# Altium schematic sheet Latch power supply.SchDoc: PowerLatch
size A3; Author: Cedric Renda; DrawnBy: Cedric Renda; Organization: HSR; Address1: Hochschule für Technik Rapperswil; Address2: Elektrotechnik; Address3: Oberseestrasse 10; Address4: CH-8640 Rapperswil
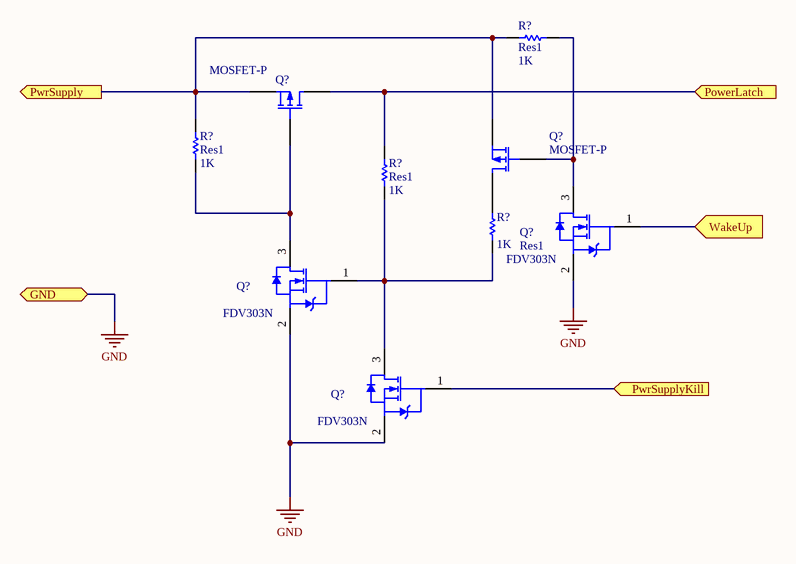
[diagram p0: Latch power supply.SchDoc]

## Parts
(Parts that share a designator on the sheet are numbered #1, #2 ... from top to bottom, then left to right.)
Q?#1  MOSFET-P  [E3]
Q?#2  MOSFET-P  [E3]
Q?#3  FDV303N  [FAIR-FDV303N-3_V]
Q?#4  FDV303N  [FAIR-FDV303N-3_V]
Q?#5  FDV303N  [FAIR-FDV303N-3_V]
R?#1  Res1  value 1K  [AXIAL-0.3]
R?#2  Res1  value 1K  [AXIAL-0.3]
R?#3  Res1  value 1K  [AXIAL-0.3]
R?#4  Res1  value 1K  [AXIAL-0.3]

## Ports
GND (bidir), PowerLatch (in), PwrSupply (out), PwrSupplyKill (in), WakeUp (in)

## Nets
GND: Q?#3.2(S) Q?#4.2(S) Q?#5.2(S) ; port GND
PowerLatch: Q?#1.1(D) R?#3.1 ; port PowerLatch
PwrSupply: Q?#1.3(S) Q?#2.3(S) R?#1.2 R?#2.1 ; port PwrSupply
PwrSupplyKill: Q?#5.1(G) ; port PwrSupplyKill
WakeUp: Q?#3.1(G) ; port WakeUp
NetQ?#1_2: Q?#1.2(G) Q?#4.3(D) R?#2.2
NetQ?#2_1: Q?#2.1(D) R?#4.2
NetQ?#2_2: Q?#2.2(G) Q?#3.3(D) R?#1.1
NetQ?#4_1: Q?#4.1(G) Q?#5.3(D) R?#3.2 R?#4.1

## Notes on the sheet
- Title
- Size:
- Date:
- A3
- Number:
- Time:
- Revision:
- Sheet
- of
- File:

## Library data of the parts
Q?#1 Q?#2 = MOSFET-P: P-Channel MOSFET; Published: 8-Jun-2000; LatestRevisionDate: 17-Jul-2002; LatestRevisionNote: Re-released for DXP Platform.; PackageVersion: 1995/1996; PackageReference: E3; Publisher: Altium Limited; PackageDescription: TO, Flat Index; 3 In-Line, Axial Leads; Body Dia. 4.6mm; Lead Dia. 0.5 mm (max)
Q?#3-Q?#5 = CMP-2000-05111-1: N-Channel MOSFET Transistor, 8 V VGSS, 25 V VDSS, 0.68 A, -55 to 150 degC, 3-Pin SOT23, RoHS, Tape and Reel; Manufacturer: Fairchild; Typical Turn-On Delay Time: 3ns; Channel Mode: Enhancement; RDS-on: 450@4.5VmOhm; Maximum Continuous Drain Current: 0.68A; Maximum Drain Source Voltage: 25V; Rad Hard: No; Typical Fall Time: 13ns; Channel Type: N; Typical Turn-Off Delay Time: 17ns; Maximum Gate Source Voltage: 8V; Typical Rise Time: 8.5ns; Mounting: SurfaceMount; Packaging: Tape&Reel; Manufacturer URL: https://www.fairchildsemi.com/; Datasheet URL: https://datasheet.ciiva.com/22681/1845307-22681736.pdf; Package: 3SOT-23; Category: MOSFET; Operating Temperature: -55to150degC; Datasheet Version: Rev. D2, 07/2014
R?#1-R?#4 = Res1: Resistor; Published: 8-Jun-2000; LatestRevisionDate: 17-Jul-2002; LatestRevisionNote: Re-released for DXP Platform.; PackageReference: AXIAL-0.3; Publisher: Altium Limited; PackageDescription: Axial Device, Thru-Hole; 2 Leads; 0.3 in Pin Spacing